# EAGLE design microBoard_DRV8842 (EAGLE 6.2)
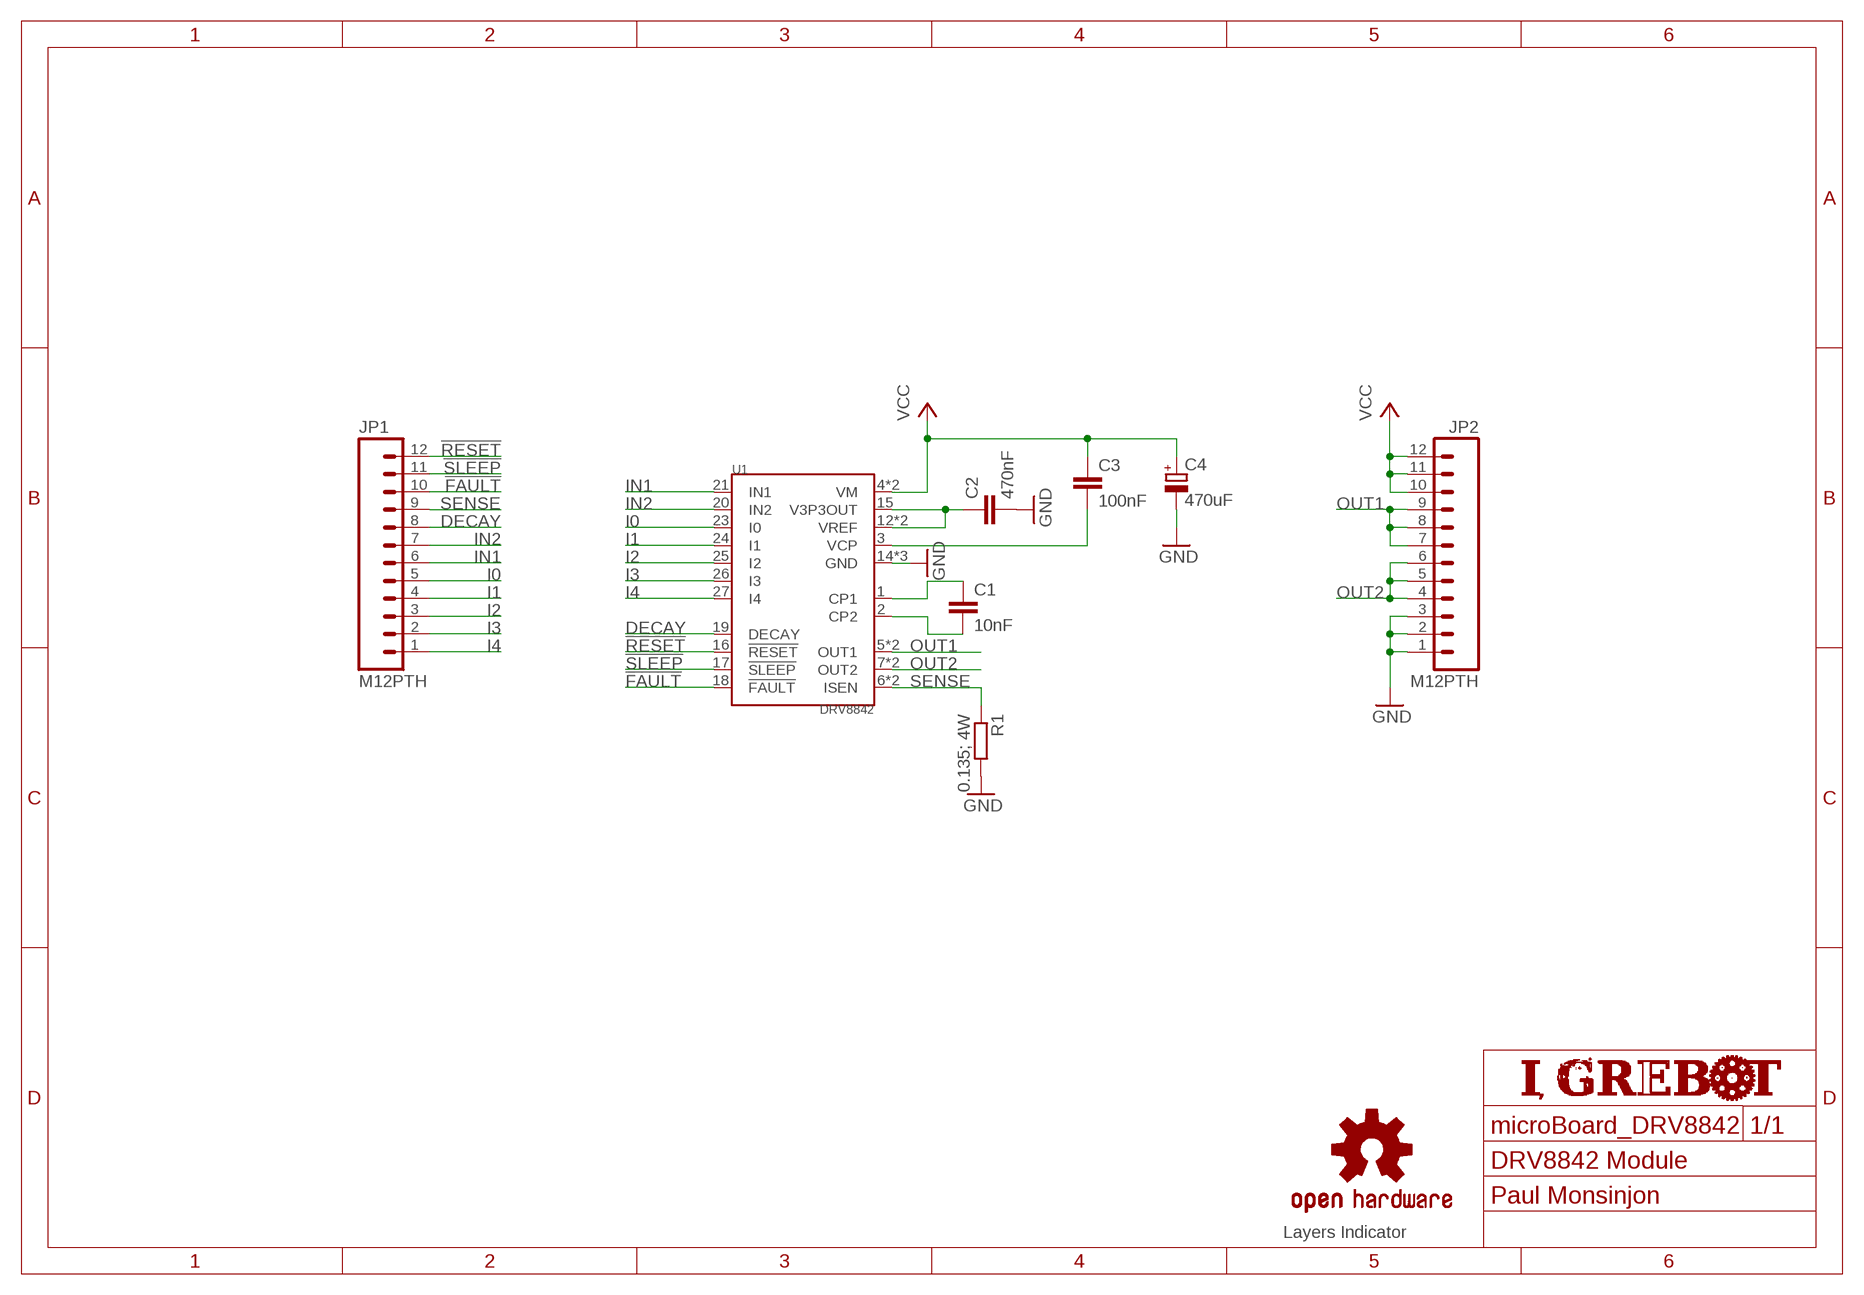
[diagram p0: schematic, sheet 1]
FRAME1 (FRAME_A4): AUTHOR: Paul Monsinjon; SHEET_NAME: DRV8842 Module

## Parts
C1  10nF  C-EUC0603  [C0603]
C2  470nF  C-EUC0603  [C0603]
C3  100nF  C-EUC0603  [C0603]
C4  470uF  CPOL-EUD  [PANASONIC_D]
JP1  M12PTH  [1X12]
JP2  M12PTH  [1X12]
LOGO1  OSHW-LOGOS  [OSHW-LOGO-S]
R1  0.135; 4W  R-EU_R2010  [R2010]
U1  DRV8842  [PWP_28]
U$1  LOGO_IGREBOT12X2MM  [IGREBOT_12X2MM]
U$2  LAYERS_CHECK4_LAYERS  [LAYERS_CHECK_4]

## Nets
!FAULT!: JP1.10 U1.18(!FAULT!)
!RESET!: JP1.12 U1.16(!RESET!)
!SLEEP!: JP1.11 U1.17(!SLEEP!)
DECAY: JP1.8 U1.19(DECAY)
GND: C2.2 C4.- JP2.1 JP2.2 JP2.3 R1.2 U1.14(GND) U1.28(GND) U1.PPAD(GND)
I0: JP1.5 U1.23(I0)
I1: JP1.4 U1.24(I1)
I2: JP1.3 U1.25(I2)
I3: JP1.2 U1.26(I3)
I4: JP1.1 U1.27(I4)
IN1: JP1.6 U1.21(IN1)
IN2: JP1.7 U1.20(IN2)
N$19: C1.1 U1.1(CP1)
N$20: C1.2 U1.2(CP2)
N$21: C3.2 U1.3(VCP)
N$22: C2.1 U1.12(VREF) U1.13(VREF) U1.15(V3P3OUT)
OUT1: JP2.7 JP2.8 JP2.9 U1.5(OUT1) U1.10(OUT1)
OUT2: JP2.4 JP2.5 JP2.6 U1.7(OUT2) U1.8(OUT2)
SENSE: JP1.9 R1.1 U1.6(ISEN) U1.9(ISEN)
VCC: C3.1 C4.+ JP2.10 JP2.11 JP2.12 U1.4(VM) U1.11(VM)

## Library data of the parts
C1-C3 = rcl:C-EU: CAPACITOR, European symbol
C4 = rcl:CPOL-EU: POLARIZED CAPACITOR, European symbol
JP1 JP2 = SparkFun-Connectors:M12: Header 12 Standard 12-pin 0.1" header. Use with straight break away headers (SKU : PRT-00116), right angle break away headers (PRT-00553), swiss pins (PRT-00743), machine pins (PRT-00117), and female headers (PRT-00115).
LOGO1 = SparkFun-Aesthetics:OSHW-LOGO: Open Source Hardware Logo This logo indicates the piece of hardware it is found on incorporates a OSHW license and/or adheres to the definition of open source hardware found here: http://freedomdefined.org/OSHW
R1 = rcl:R-EU_: RESISTOR, European symbol
U1 = microLib:DRV8842
U$1 = microLib:LOGO_IGREBOT
U$2 = microLib:LAYERS_CHECK

## Board
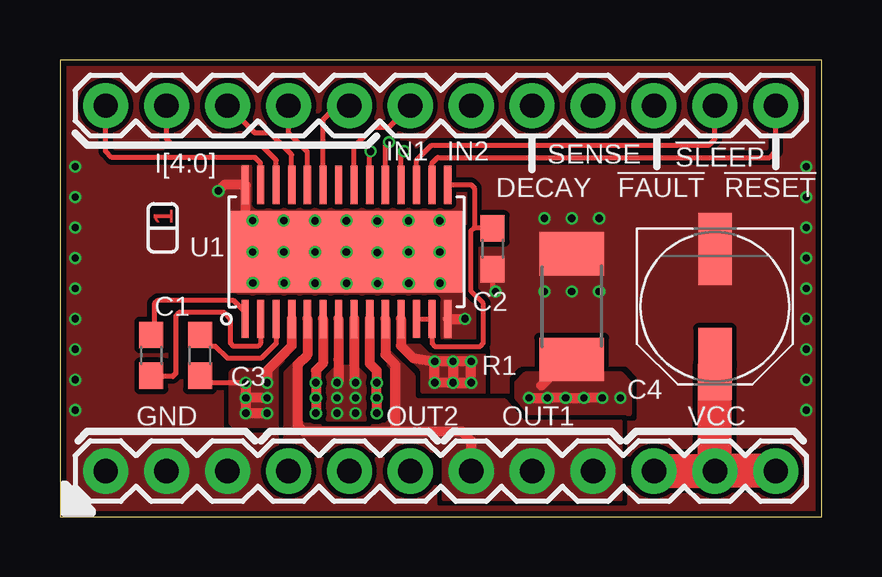
[diagram p1: board, top side]
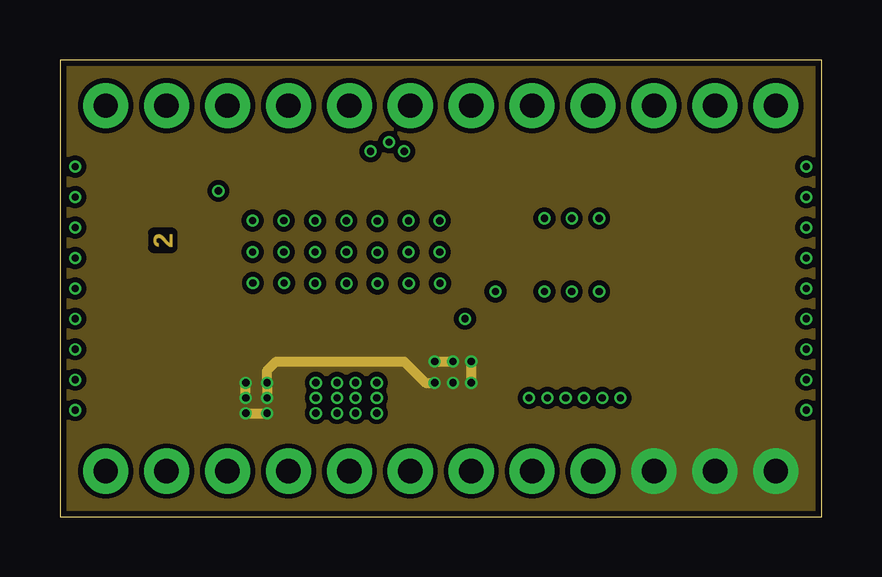
[diagram p2: board, inner layer Route2]
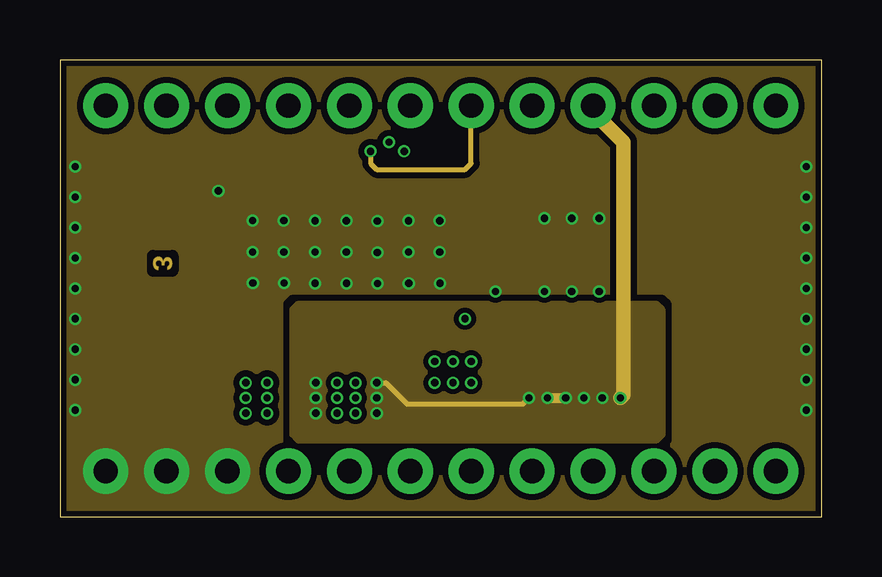
[diagram p3: board, inner layer Route15]
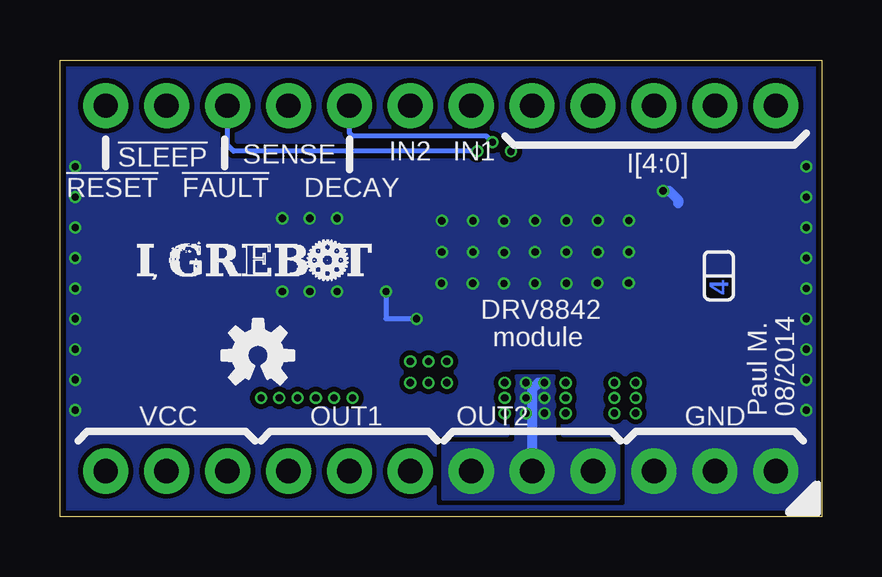
[diagram p4: board, bottom side, seen from below]

Size 31.75 x 19.05 mm. Coordinates in mm from the lower left corner, seen from the top.
Outline: 0,0 31.75,0 31.75,19.05 0,19.05 0,0
Copper layers (1*2*15*16): Top 0.035mm / dielectric 0.2mm / Route2 0.0175mm / dielectric 0.3mm / Route15 0.0175mm / dielectric 0.2mm / Bottom 0.035mm
Design rules: minimum track width 8mil, minimum drill 0.3mm, track to track 8mil, track to pad 8mil, pad to pad 8mil, via to via 8mil, smd to smd 0mil, copper to edge 10mil, drill to drill 8mil, minimum pad ring 6mil, minimum via ring 4mil, stop-mask expansion 4mil, vias tented up to drill 100mil, thermal gap 10mil

### Footprints (pad centres in the part's own frame; a part is rotated, then mirrored left to right if it is on the bottom)
C0603 = smd 1.1 x 1: 1 -0.85,0; 2 0.85,0
PANASONIC_D = smd 3 x 1.4: + 2.4,0; - -2.4,0
1X12 = drill 1.016 pad 1.88: 1 0,0; 2 2.54,0; 3 5.08,0; 4 7.62,0; 5 10.16,0; 6 12.7,0; 7 15.24,0; 8 17.78,0; 9 20.32,0; 10 22.86,0; 11 25.4,0; 12 27.94,0
R2010 = smd 1.8 x 2.7: 1 -2.2,0; 2 2.2,0
PWP_28 = smd 0.3 x 1.6: 1 -4.225,-2.8; 2 -3.575,-2.8; 3 -2.925,-2.8; 4 -2.275,-2.8; 5 -1.625,-2.8; 6 -0.975,-2.8; 7 -0.325,-2.8; 8 0.325,-2.8; 9 0.975,-2.8; 10 1.625,-2.8; 11 2.275,-2.8; 12 2.925,-2.8; 13 3.575,-2.8; 14 4.225,-2.8; 15 4.225,2.8; 16 3.575,2.8; 17 2.925,2.8; 18 2.275,2.8; 19 1.625,2.8; 20 0.975,2.8; 21 0.325,2.8; 22 -0.325,2.8; 23 -0.975,2.8; 24 -1.625,2.8; 25 -2.275,2.8; 26 -2.925,2.8; 27 -3.575,2.8; 28 -4.225,2.8 | smd 9.7 x 3.4: PPAD 0,0

### Placement (x,y rotation side)
C1  3.81,6.73 270 top
C2  18.03,11.18 270 top
C3  5.84,6.73 90 top
C4  27.3,8.76 270 top
JP1  1.91,17.14 0 top
JP2  1.91,1.91 0 top
LOGO1  23.5,6.73 0 bottom
R1  21.34,8.76 90 top
U1  11.94,11.05 0 top
U$1  28.57,10.03 0 bottom
U$2  3.68,11.05 270 top

### Tracks (layer width: path | path; a pad name or v marks a point on that pad's centre or on a via)
!FAULT!  (via drill 0.3)
  Top 0.203: U1.18 14.21,15.1 v14.35,15.24
  Bottom 0.203: JP1.10 24.77,15.49 24.51,15.24 v14.35,15.24
!RESET!
  Top 0.203: U1.16 15.51,14.75 15.75,14.99 29.59,14.99 29.84,15.24 JP1.12
!SLEEP!
  Top 0.203: U1.17 14.86,14.86 15.49,15.49 27.05,15.49 27.3,15.75 JP1.11
DECAY  (via drill 0.3)
  Top 0.203: U1.19 13.56,15.47 v13.72,15.62
  Bottom 0.203: v13.72,15.62 13.97,15.88 19.56,15.88 19.68,16 JP1.8
GND  (via drill 0.3)
  Top 0.203: v16.89,8.25 v16.89,8.26 | C2.2 18.03,9.53 v18.16,9.4
  Top 0.406: U1.14 v16.89,8.25 | U1.PPAD 9.27,11.05 7.75,12.57 7.75,13.81 U1.28 6.86,13.85 v6.6,13.59
  Bottom 0.203: v16.89,8.26 18.16,8.26 v18.16,9.4
  Bottom 0.406: 5.97,13.08 5.97,13.21 6.35,13.59 v6.6,13.59
  other vias: 20.19,9.4 20.19,12.45 21.34,12.45 22.48,12.45 21.34,9.4 22.48,9.4 15.83,12.35 14.53,12.35 13.23,12.34 11.94,12.35 10.63,12.35 9.33,12.36 8.03,12.36 15.83,11.04 14.53,11.04 13.23,11.03 11.94,11.04 10.63,11.04 9.33,11.04 8.03,11.04 15.84,9.73 14.54,9.73 13.24,9.72 11.95,9.73 10.64,9.73 9.34,9.74 8.04,9.74 0.64,14.61 0.64,12.06 0.64,9.53 0.64,6.99 0.64,4.45 31.11,14.61 31.11,12.06 31.11,9.53 31.11,6.99 31.11,4.45 0.64,13.34 0.64,10.79 0.64,8.26 0.64,5.71 31.11,13.34 31.11,10.79 31.11,8.26 31.11,5.71
  pour Bottom (isolate 0.203, rank 6, no thermals): 0,19.05 31.75,19.05 31.75,0 0.13,0 0,-0.13
  pour Top (isolate 0.203, rank 6, no thermals): 0,19.05 31.75,19.05 31.75,0 0,0
  pour Route15 (isolate 0.254, rank 6, no thermals): 0,0 31.75,0 31.75,19.05 0,19.05
I0
  Top 0.203: U1.23 10.96,16.55 11.3,16.89 11.81,16.89 JP1.5
I1
  Top 0.203: U1.24 10.31,15.21 9.53,16 JP1.4
I2
  Top 0.203: U1.25 9.66,15.1 8.76,16 8.13,16 JP1.3
I3
  Top 0.203: U1.26 9.01,14.86 8.38,15.49 4.7,15.49 4.45,15.75 JP1.2
I4
  Top 0.203: U1.27 8.36,14.75 8.13,14.99 2.16,14.99 1.91,15.24 JP1.1
IN1
  Top 0.203: U1.21 12.26,15.44 13.08,16.26 13.72,16.26 JP1.6
IN2  (via drill 0.3)
  Top 0.203: U1.20 12.91,15.2 v12.95,15.24
  Route15 0.203: v12.95,15.24 12.95,14.73 13.21,14.48 16.89,14.48 17.14,14.73 JP1.7
N$19
  Top 0.203: U1.1 7.71,8.54 7.24,9.02 4.06,9.02 3.94,8.89 3.94,7.71 C1.1
N$20
  Top 0.203: U1.2 8.36,7.22 8.26,7.11 7.24,7.11 7.11,7.24 7.11,8.26 6.86,8.51 4.95,8.51 4.83,8.38 4.83,5.97 4.7,5.84 3.85,5.84 C1.2
N$21
  Top 0.203: U1.3 9.01,7.24 8.38,6.6 6.99,6.6 6.48,7.11 6.31,7.11 C3.2
N$22
  Top 0.203: U1.12 U1.13 15.51,7.22 15.62,7.11 17.53,7.11 17.65,7.24 17.65,8.89 17.14,9.4 17.14,11.94 17.27,12.06 | 17.27,12.06 18,12.06 C2.1 | U1.15 17.14,13.85 17.27,13.72 17.27,12.06
OUT1
  Top 0.406: U1.10 13.56,6.76 13.97,6.35 13.97,3.68 14.1,3.56 | U1.5 10.31,6.76 9.91,6.35 9.91,3.81 10.16,3.56 14.1,3.56 | 14.1,3.56 16.76,3.56 17.14,3.17 JP2.7
  pour Top (rank 2, no thermals): 9.78,6.35 9.4,5.97 9.4,3.05 9.65,2.79 15.75,2.79 16,2.54 16,0.76 23.37,0.76 23.37,3.94 19.3,3.94 18.54,4.83 14.86,4.83 14.73,4.95 14.73,5.84 13.72,6.86 13.72,6.35 13.84,6.22 13.84,4.06 13.59,3.81 10.16,3.81 10.03,3.94 10.03,6.35
OUT2  (via drill 0.3)
  Top 0.406: 11.61,6.55 U1.7 11.61,5.64 v11.56,5.59 | U1.8 12.26,5.64 v12.32,5.59
  Bottom 0.406: v11.56,5.59 11.81,5.59 12.06,5.33 JP2.5
  other vias: 12.32,4.95 11.56,4.95 11.56,4.32 12.32,4.32
  pour Top: 11.18,5.84 11.18,4.06 12.7,4.06 12.7,5.84 12.32,6.22 11.56,6.22
  pour Bottom (no thermals): 8.51,0.76 15.75,0.76 15.75,3.05 12.83,3.05 12.7,3.17 12.7,5.84 11.18,5.84 11.18,3.17 11.05,3.05 8.51,3.05
SENSE  (via drill 0.3)
  Top 0.406: U1.9 12.91,6.39 13.21,6.1 v13.21,5.59 v13.21,4.95 v13.21,4.32 | U1.6 10.96,6.39 10.67,6.1 v10.67,4.32 | v19.56,4.95 v20.32,4.95 v21.08,4.95 v21.84,4.95 v22.61,4.95 | R1.1 20.57,5.96 20.07,5.46
  Route15 0.203: v13.21,5.59 13.59,5.59 14.48,4.7 19.3,4.7 v19.56,4.95
  Route15 0.406: v20.32,4.95 v21.08,4.95
  Route15 0.61: JP1.9 22.23,16.89 23.5,15.62 23.5,5.08 v23.37,4.95
  other vias: 10.67,4.95 10.67,5.59
  pour Route15 (isolate 0.203, no thermals): 24.89,8.89 9.91,8.89 9.65,8.64 9.65,3.43 9.91,3.17 24.89,3.17 25.15,3.43 25.15,8.64
  pour Top (isolate 0.203, rank 3, no thermals): 19.43,5.97 23.37,5.97 23.75,5.59 23.75,4.32 23.62,4.19 19.18,4.19 19.05,4.32 19.05,5.59
VCC  (via drill 0.3)
  Top 0.203: v7.75,5.59 5.84,5.59 C3.1
  Top 0.406: U1.11 14.21,7.12 14.72,6.62 v15.62,6.48 | v15.62,6.48 v15.62,5.59 v17.14,5.59 | U1.4 9.66,7.12 8.64,6.1 v8.64,5.59 | v8.64,4.95 v7.75,4.95 | v7.75,5.59 v7.75,4.32 v8.64,4.32 | v16.38,6.48 v15.62,6.48 | v17.14,5.59 v17.14,6.48 v16.38,6.48 | v16.38,6.48 v16.38,5.59 v17.14,5.59
  Top 1.422: JP2.10 JP2.11 | JP2.12 JP2.11 | JP2.11 C4.+
  Route2 0.406: v15.62,5.59 15.24,5.59 14.35,6.48 9.02,6.48 8.64,6.1 v8.64,5.59 v8.64,4.95 | v7.75,4.95 v7.75,5.59 | v7.75,4.32 v8.64,4.32 | v15.62,6.48 v16.38,6.48 | v17.14,6.48 v17.14,5.59
  pour Top (isolate 0.203, rank 3, no thermals): 9.27,6.86 8.51,6.1 7.24,6.1 7.11,5.97 7.11,3.94 7.24,3.81 9.14,3.81 9.27,3.94 9.27,6.6 9.53,6.86
  pour Top (isolate 0.203, rank 4, no thermals): 14.22,6.99 15.11,6.1 15.11,5.08 17.65,5.08 17.65,6.73 15.37,6.73 14.99,7.11 14.22,7.11
  pour Route2 (isolate 0.203, no thermals): 0,19.05 31.75,19.05 31.62,0 0.13,0

### Text on the board
tNames: IN1 | IN2 | SENSE | !SLEEP! | I[4:0] | DECAY | !FAULT! | !RESET! | GND | OUT2 | OUT1 | VCC
bNames: IN1 | IN2 | SENSE | !SLEEP! | I[4:0] | DECAY | !FAULT! | !RESET! | DRV8842 | module | 08/2014 | Paul M. | GND | OUT2 | OUT1 | VCC